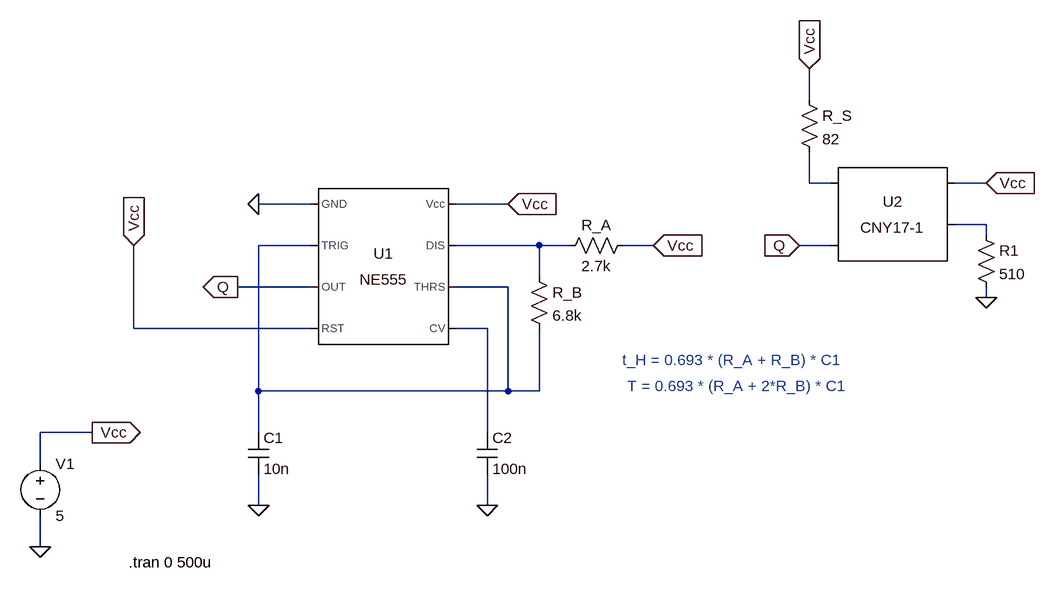
[diagram p0: schematic Emetteur_v1.asc]
Emetteur_v1.asc, the LTspice schematic file:
Version 4
SHEET 1 1188 680
WIRE 816 -64 816 -112
WIRE 816 64 816 16
WIRE 848 64 816 64
WIRE 1088 64 1040 64
WIRE 48 96 -32 96
WIRE 352 96 272 96
WIRE 1088 128 1040 128
WIRE 1088 144 1088 128
WIRE 48 160 -32 160
WIRE 400 160 272 160
WIRE 448 160 400 160
WIRE 576 160 528 160
WIRE 848 160 800 160
WIRE 400 208 400 160
WIRE 48 224 -64 224
WIRE 352 224 272 224
WIRE 1088 240 1088 224
WIRE -224 288 -224 160
WIRE 48 288 -224 288
WIRE 320 288 272 288
WIRE -32 384 -32 160
WIRE 352 384 352 224
WIRE 352 384 -32 384
WIRE 400 384 400 288
WIRE 400 384 352 384
WIRE -288 448 -368 448
WIRE -32 448 -32 384
WIRE 320 448 320 288
WIRE -368 496 -368 448
WIRE -32 560 -32 512
WIRE 320 560 320 512
WIRE -368 624 -368 576
FLAG -368 624 0
FLAG -288 448 Vcc
IOPIN -288 448 Out
FLAG 352 96 Vcc
IOPIN 352 96 In
FLAG -32 96 0
FLAG -32 560 0
FLAG 320 560 0
FLAG 576 160 Vcc
IOPIN 576 160 In
FLAG -224 160 Vcc
IOPIN -224 160 In
FLAG -64 224 Q
IOPIN -64 224 Out
FLAG 800 160 Q
IOPIN 800 160 In
FLAG 816 -112 Vcc
IOPIN 816 -112 In
FLAG 1088 240 0
FLAG 1088 64 Vcc
IOPIN 1088 64 In
SYMBOL Misc\\NE555 160 192 R0
SYMATTR InstName U1
SYMBOL voltage -368 480 R0
WINDOW 123 0 0 Left 2
WINDOW 39 0 0 Left 2
SYMATTR InstName V1
SYMATTR Value 5
SYMBOL cap -48 448 R0
SYMATTR InstName C1
SYMATTR Value 10n
SYMBOL cap 304 448 R0
SYMATTR InstName C2
SYMATTR Value 100n
SYMBOL res 384 192 R0
SYMATTR InstName R_B
SYMATTR Value 6.8k
SYMBOL res 544 144 R90
WINDOW 0 0 56 VBottom 2
WINDOW 3 32 56 VTop 2
SYMATTR InstName R_A
SYMATTR Value 2.7k
SYMBOL Optos\\CNY17-1 944 128 R0
SYMATTR InstName U2
SYMBOL res 800 -80 R0
SYMATTR InstName R_S
SYMATTR Value 82
SYMBOL res 1072 128 R0
SYMATTR InstName R1
SYMATTR Value 510
TEXT -232 648 Left 2 !.tran 0 500u
TEXT 528 336 Left 2 ;t_H = 0.693 * (R_A + R_B) * C1
TEXT 536 376 Left 2 ;T = 0.693 * (R_A + 2*R_B) * C1

The netlist it stands for:
* Emetteur_v1.asc
XU1 0 N003 Q Vcc N005 N003 N004 Vcc NE555  ; pins GND TRIG OUT RST CV THRS DIS Vcc
V1 Vcc 0 5
C1 N003 0 10n
C2 N005 0 100n
R_B N004 N003 6.8k
R_A Vcc N004 2.7k
XU2 N001 Q Vcc N002 NC_01 CNY17 Igain=.724m
R_S Vcc N001 82
R1 N002 0 510
.tran 0 500u
* t_H = 0.693 * (R_A + R_B) * C1
* T = 0.693 * (R_A + 2*R_B) * C1
.lib NE555.sub
.lib CNY17.sub
.backanno
.end